# Altium schematic sheet Top_Sheet_Controller.SchDoc
size B; Organization: Altium Limited; Address1: L3, 12a Rodborough Rd; Address2: Frenchs Forest; Address3: NSW; Address4: Australia 2086; SheetNumber: 1; SheetTotal: 1
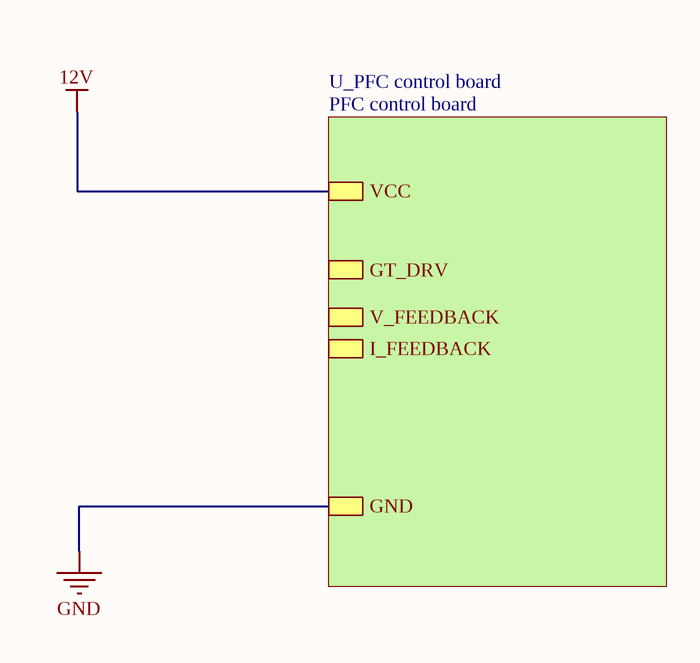
[diagram p0: Top_Sheet_Controller.SchDoc]

## Sub-sheets
U_PFC control board = PFC control board: GND, GT_DRV, I_FEEDBACK, V_FEEDBACK, VCC

## Nets
12V: sheet U_PFC control board/VCC
GND: sheet U_PFC control board/GND

## Notes on the sheet
- Title:
- Size:
- B
- Document Number:
- Revision:
- Designer:
- Approval Date:
- Start Date:
- MM/DD/YY
- --/--/--
- Sheet:
- of
- Approver:
- CONFIDENTIAL
- Project Name/Number: